# Altium project RP5-Right_Board.PrjPcb
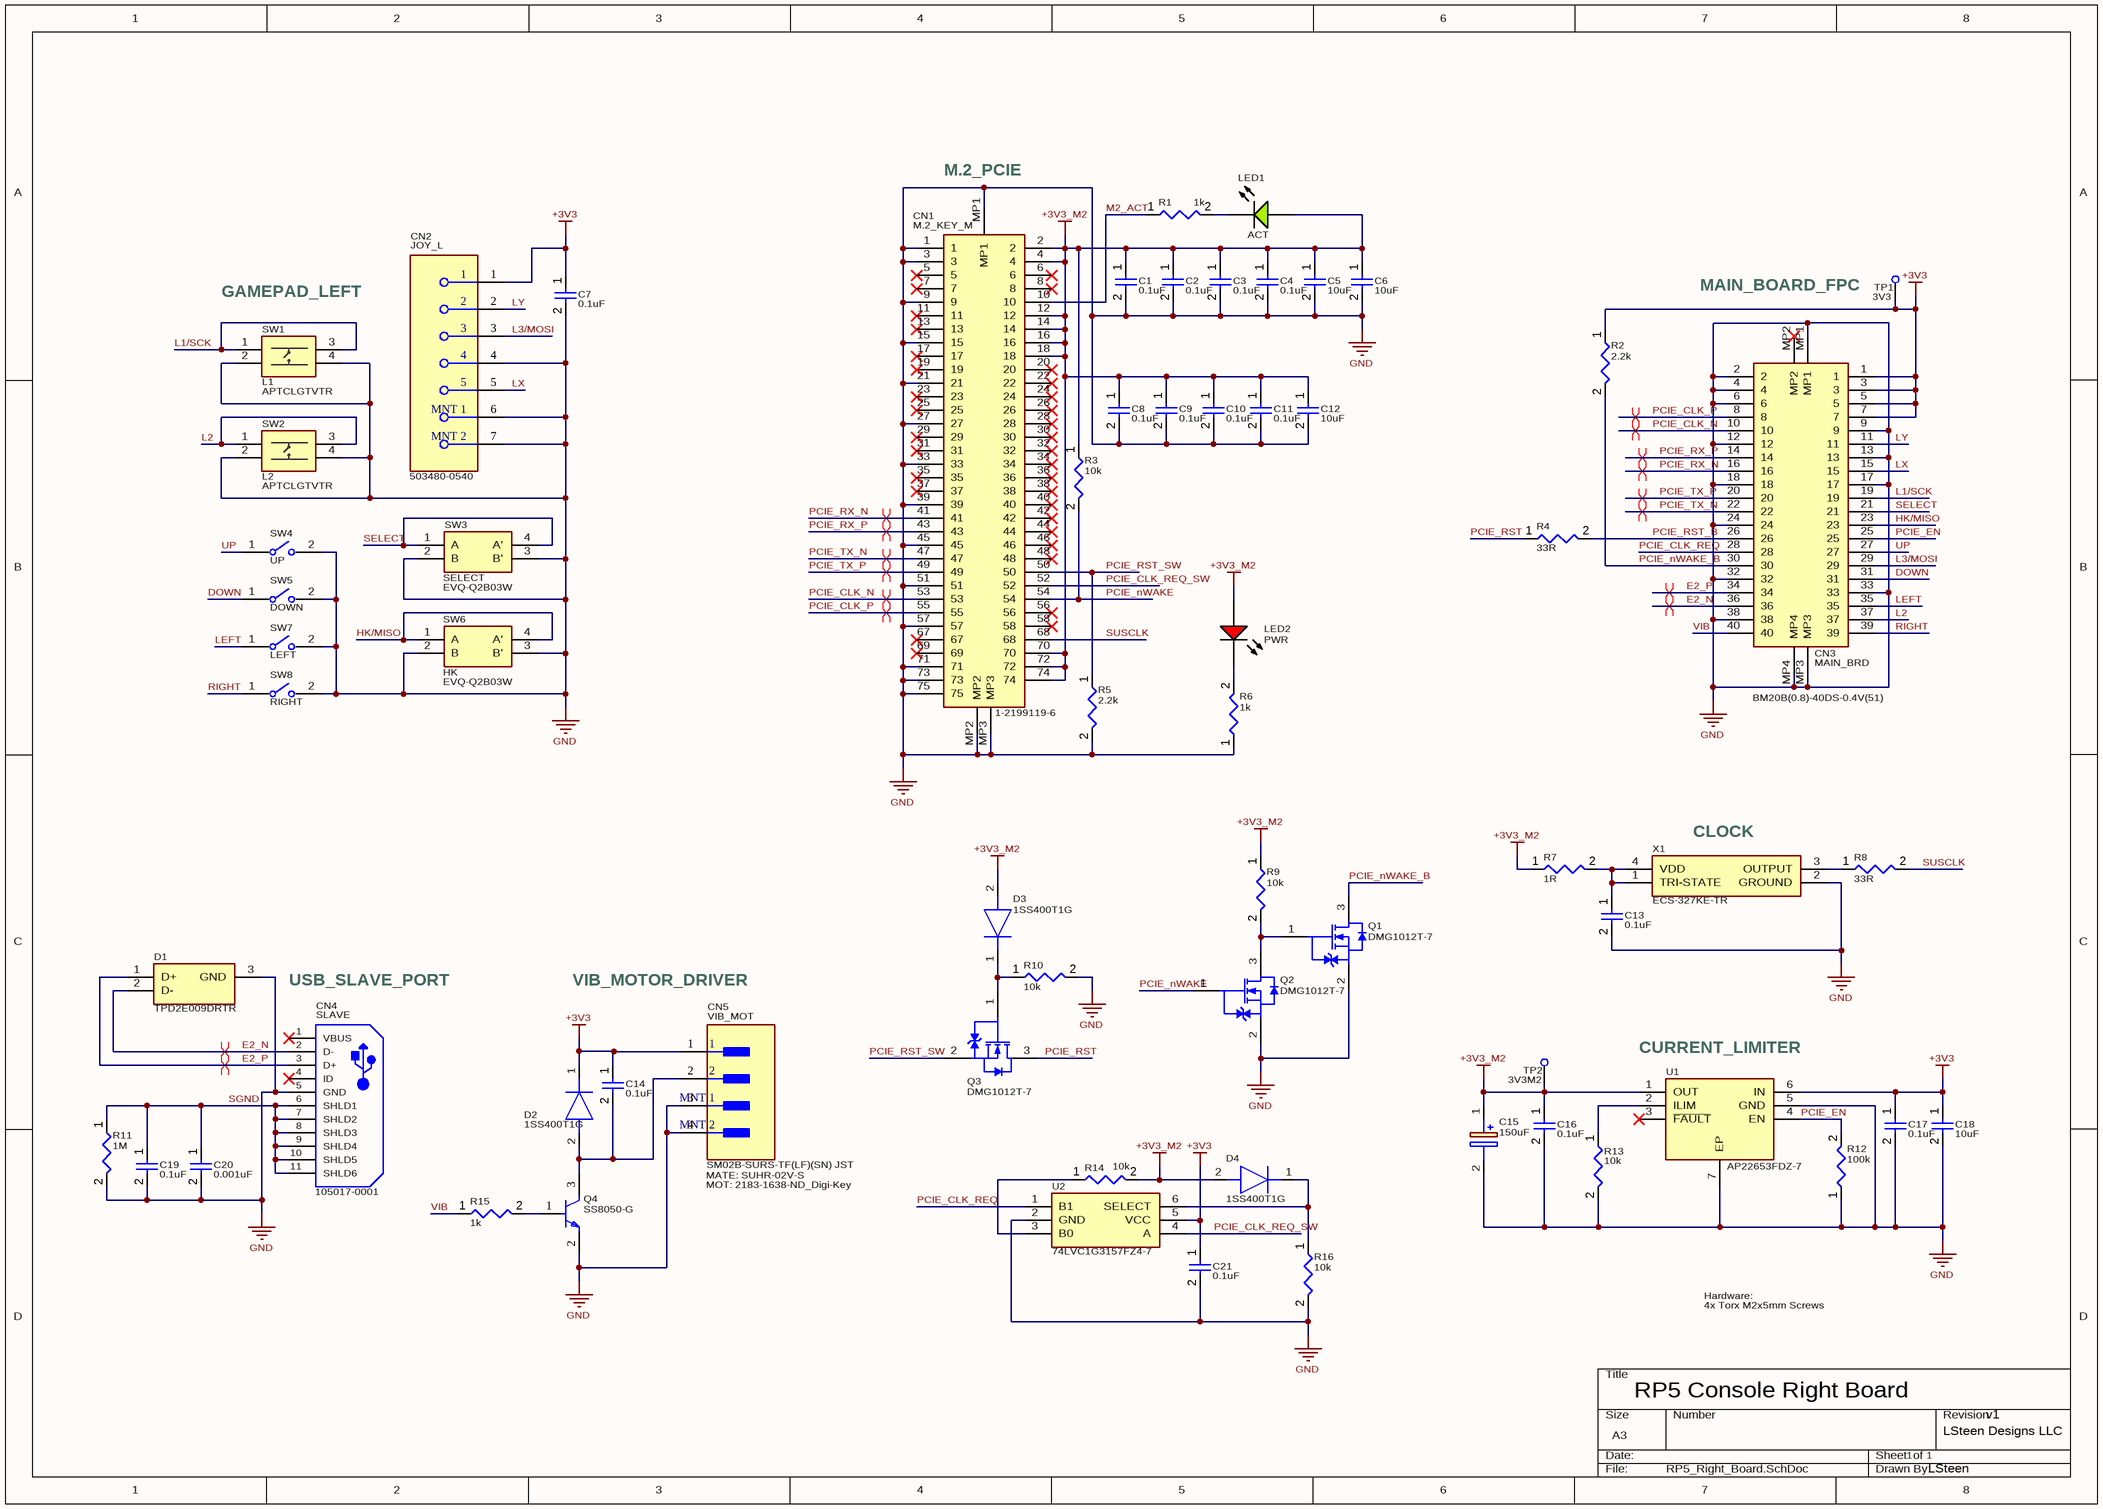
[diagram p0: RP5_Right_Board.SchDoc]
CAGE_CODE: ?????; CONTRACT_NUMBER: <CONTRACT NO>; DOC_NO_ASSY_DWG: <ASSY DWG NO>; DOC_NO_BOM: <BOM DOC NO>; DOC_NO_FAB_DWG: <FAB DWG NO>; DOC_NO_SCH_DWG: <SCH DWG NO>; PCB_2_DEC_TOL: +/-.01; PCB_3_DEC_TOL: +/-.010; PCB_ANG_TOL: +/-1/2; PCB_ASSEMBLY_NO: <PCB ASSY NO>; PCB_CHECKER: - -----; PCB_CHECKER_APP_DATE: --/--/----; PCB_DESIGNER: - -----; PCB_DESIGNER_APP_DATE: --/--/----; PCB_DWG_NO: <PCB DWG NO>; PCB_ENGINEER: - -----; PCB_ENGINEER_APP_DATE: --/--/----; PCB_PART_NUMBER: <PCB PN>; PCB_REV: A; SCH_REV: A
1 sheet, 65 parts. Net scope: global (net labels, ports and power ports of the same name join across sheets).
Board file: Right_Board.PcbDoc

## Sheet RP5_Right_Board.SchDoc
size A3; SheetNumber: 1; SheetTotal: 1; ENG_APP_DATE: --/--/--; DSN_APP_DATE: --/--/--; CHK_APP_DATE: --/--/--

### Parts
C1  0.1uF  [CAPC1005X56X25LL10T15]
C2  0.1uF  [CAPC1005X56X25LL10T15]
C3  0.1uF  [CAPC1005X56X25LL10T15]
C4  0.1uF  [CAPC1005X56X25LL10T15]
C5  10uF  [CAPC0805(2012)145_L]
C6  10uF  [CAPC0805(2012)145_L]
C7  0.1uF  [CAPC1005X56X25LL10T15]
C8  0.1uF  [CAPC1005X56X25LL10T15]
C9  0.1uF  [CAPC1005X56X25LL10T15]
C10  0.1uF  [CAPC1005X56X25LL10T15]
C11  0.1uF  [CAPC1005X56X25LL10T15]
C12  10uF  [CAPC0805(2012)145_L]
C13  0.1uF  [CAPC1005X56X25LL10T15]
C14  0.1uF  [CAPC1005X56X25LL10T15]
C15  150uF  [CAPPM7344X310N]
C16  0.1uF  [CAPC1005X56X25LL10T15]
C17  0.1uF  [CAPC1005X56X25LL10T15]
C18  10uF  [CAPC0805(2012)145_L]
C19  0.1uF  [CAPC1005X56X25LL10T15]
C20  0.001uF  [CAPC1005X56X25LL10T15]
C21  0.1uF  [CAPC1005X56X25LL10T15]
CN1  M.2_KEY_M  [121991196]
CN2  JOY_L  [FP-503480-0540-MFG]
CN3  MAIN_BRD  [BM20B0840DS04V51]
CN4  SLAVE  [105017-0001]
CN5  VIB_MOT  [FP-SM02B-SURS-TF_LF_SN-MFG]
D1  TPD2E009DRTR  [SOTFL35P100X50-3N]
D2  1SS400T1G  [SODFL1608X70N]
D3  1SS400T1G  [SODFL1608X70N]
D4  1SS400T1G  [SODFL1608X70N]
LED1  ACT  [LED_0603]
LED2  PWR  [EVRL-0603-2_V]
Q1  DMG1012T-7  [DIOD-SOT523-3_V]
Q2  DMG1012T-7  [DIOD-SOT523-3_V]
Q3  DMG1012T-7  [DIOD-SOT523-3_V]
Q4  SS8050-G  [FP-SS8050-G-MFG]
R1  1k  [RESC0402(1005)_L]
R2  2.2k  [RESC0402(1005)_L]
R3  10k  [RESC0402(1005)_L]
R4  33R  [RESC0402(1005)_L]
R5  2.2k  [RESC0402(1005)_L]
R6  1k  [RESC0402(1005)_L]
R7  1R  [RESC0402(1005)_L]
R8  33R  [RESC0402(1005)_L]
R9  10k  [RESC0402(1005)_L]
R10  10k  [RESC0402(1005)_L]
R11  1M  [RESC0402(1005)_L]
R12  100k  [RESC0402(1005)_L]
R13  10k  [RESC0402(1005)_L]
R14  10k  [RESC0402(1005)_L]
R15  1k  [RESC0402(1005)_L]
R16  10k  [RESC0402(1005)_L]
SW1  L1  [APTCLGTVTR]
SW2  L2  [APTCLGTVTR_No_Holes]
SW3  SELECT  [EVQQ2]
SW4  UP  [L4.0-W4.0-CNDV-PAD]
SW5  DOWN  [L4.0-W4.0-CNDV-PAD]
SW6  HK  [EVQQ2]
SW7  LEFT  [L4.0-W4.0-CNDV-PAD]
SW8  RIGHT  [L4.0-W4.0-CNDV-PAD]
TP1  3V3  [TP]  (no BOM)
TP2  3V3M2  [TP]  (no BOM)
U1  AP22653FDZ-7  [SON65P200X200X80-7N-D]
U2  74LVC1G3157FZ4-7  [74LVC1G3157FZ47]
X1  ECS-327KE-TR  [ECS327KETR]

### Nets
+3V3: C7.1 C14.1 C17.1 C18.1 C21.1 CN2.1 CN3.1 CN3.3 CN3.5 CN3.7 CN5.1 D2.1(K) R2.1 TP1.1 U1.6(IN) U2.5(VCC)
+3V3_M2: C1.1 C2.1 C3.1 C4.1 C5.1 C6.1 C8.1 C9.1 C10.1 C11.1 C12.1 C15.1(+) C16.1 CN1.2 CN1.4 CN1.12 CN1.14 CN1.16 CN1.18 CN1.70 CN1.72 CN1.74 D3.2(A) D4.2(A) LED1.1(A) LED2.1(A) R3.1 R7.1 R9.1 R14.2 TP2.1 U1.1(OUT)
GND: C1.2 C2.2 C3.2 C4.2 C5.2 C6.2 C7.2 C8.2 C9.2 C10.2 C11.2 C12.2 C13.2 C15.2(-) C16.2 C17.2 C18.2 C19.2 C20.2 C21.2 CN1.1 CN1.3 CN1.9 CN1.15 CN1.21 CN1.27 CN1.33 CN1.39 CN1.45 CN1.51 CN1.57 CN1.71 CN1.73 CN1.75 CN1.MP1 CN1.MP2 CN1.MP3 CN2.4 CN2.6(MNT_1) CN2.7(MNT_2) CN3.2 CN3.4 CN3.6 CN3.9 CN3.12 CN3.13 CN3.17 CN3.18 CN3.24 CN3.32 CN3.33 CN3.38 CN3.MP1 CN3.MP3 CN3.MP4 CN4.5(GND) CN5.3(MNT_1) CN5.4(MNT_2) D1.3(GND) Q1.2(S) Q2.2(S) Q4.2(E) R5.2 R6.1 R10.2 R11.2 R12.1 R13.2 R16.2 SW1.2 SW1.4 SW2.2 SW2.4 SW3.2(B) SW3.3(B') SW4.2 SW5.2 SW6.2(B) SW6.3(B') SW7.2 SW8.2 U1.5(GND) U1.7(EP) U2.2(GND) X1.2(GROUND)
DOWN: CN3.31 SW5.1
E2_N: CN3.36 CN4.2(D-) D1.2(D-)
E2_P: CN3.34 CN4.3(D+) D1.1(D+)
HK/MISO: CN3.23 SW6.1(A) SW6.4(A')
L1/SCK: CN3.19 SW1.1 SW1.3
L2: CN3.37 SW2.1 SW2.3
L3/MOSI: CN2.3 CN3.29
LEFT: CN3.35 SW7.1
LX: CN2.5 CN3.15
LY: CN2.2 CN3.11
M2_ACT: CN1.10 R1.1
PCIE_CLK_N: CN1.53 CN3.10
PCIE_CLK_P: CN1.55 CN3.8
PCIE_CLK_REQ: CN3.28 U2.1(B1)
PCIE_CLK_REQ_SW: CN1.52 U2.4(A)
PCIE_EN: CN3.25 R12.2 U1.4(EN)
PCIE_nWAKE: CN1.54 Q2.1(G) R3.2
PCIE_nWAKE_B: CN3.30 Q1.3(D) R2.2
PCIE_RST: Q3.3(D) R4.1
PCIE_RST_B: CN3.26 R4.2
PCIE_RST_SW: CN1.50 Q3.2(S) R5.1
PCIE_RX_N: CN1.41 CN3.16
PCIE_RX_P: CN1.43 CN3.14
PCIE_TX_N: CN1.47 CN3.22
PCIE_TX_P: CN1.49 CN3.20
RIGHT: CN3.39 SW8.1
SELECT: CN3.21 SW3.1(A) SW3.4(A')
SGND: C19.1 C20.1 CN4.6(SHLD1) CN4.7(SHLD2) CN4.8(SHLD3) CN4.9(SHLD4) CN4.10(SHLD5) CN4.11(SHLD6) R11.1
SUSCLK: CN1.68 R8.2
UP: CN3.27 SW4.1
VIB: CN3.40 R15.1
NetC13_1: C13.1 R7.2 X1.1(TRI-STATE) X1.4(VDD)
NetC14_2: C14.2 CN5.2 D2.2(A) Q4.3(C)
NetD3_1: D3.1(K) Q3.1(G) R10.1
NetD4_1: D4.1(K) R16.1 U2.6(SELECT)
NetLED1_2: LED1.2(K) R1.2
NetLED2_2: LED2.2(K) R6.2
NetQ1_1: Q1.1(G) Q2.3(D) R9.2
NetQ4_1: Q4.1(B) R15.2
NetR8_1: R8.1 X1.3(OUTPUT)
NetR13_1: R13.1 U1.2(ILIM)
NetR14_1: R14.1 U2.3(B0)

Not connected (* = marked no-connect by the designer): CN1 5* 6* 7* 8* 11* 13* 17* 19* 20* 22* 23* 24* 25* 26* 28* 29* 30* 31* 32* 34* 35* 36* 37* 38* 40* 42* 44* 46* 48* 56* 58* 67* 69*; CN3 MP2*; CN4 1(VBUS)* 4(ID)*; U1 3(~{FAULT})*

### Layout directives
differential pair; differential pair class USB 2.0: E2_N, E2_P
differential pair; differential pair class PCIe Gen 3x1: PCIE_CLK_N, PCIE_CLK_P, PCIE_RX_N, PCIE_RX_P, PCIE_TX_N, PCIE_TX_P

### Notes on the sheet
- M.2_PCIE
- (near SW1) GAMEPAD_LEFT
- MAIN_BOARD_FPC
- (near SW1) APTCLGTVTR
- (near SW2) APTCLGTVTR
- (near CN2) 503480-0540
- (near SW3) EVQ-Q2B03W
- (near SW6) EVQ-Q2B03W
- (near CN1) 1-2199119-6
- (near CN3) BM20B(0.8)-40DS-0.4V(51)
- (near X1) CLOCK
- USB_SLAVE_PORT
- VIB_MOTOR_DRIVER
- (near U1) CURRENT_LIMITER
- (near CN4) 105017-0001
- (near CN5) MOT: 2183-1638-ND_Digi-Key
- (near CN5) MATE: SUHR-02V-S
- (near CN5) SM02B-SURS-TF(LF)(SN) JST
- Hardware:
- 4x Torx M2x5mm Screws
- RP5 Console Right Board
- 1
- LSteen Designs LLC
- v1
- LSteen
- DWG. NO.
- REV.
- SHT.
- THIS DOCUMENT AND THE DATA DISCLOSED HEREIN OR HEREWITH IS THE PROPERTY OF ALTIUM LIMITED AND MAY BE FREELY DISTRIBUTED IN WHOLE. NO RIGHTS ARE RESERVED OR EXPRESS OR IMPLIED WARANTEE GIVEN.
- REVISION
- DESCRIPTION
- DATE
- APPROVED
- ENG:
- APPROVALS
- PROJECT
- DSN:
- CHK:
- REFERENCE DOCUMENTS
- PROJECT REVISION:
- TITLE
- DOCUMENT REVISION:
- DESIGN ITEM:
- BOM:
- FAB DWG:
- PCB DWG:
- ASSY DWG:
- SCALE:
- SIZE
- B
- CAGE CODE
- FILE NAME
- DWG NO.
- SHEET
- OF
- REV

### Library data of the parts
C1-C4 C7-C11 C13 C14 C16 C17 C19 C21 = CMP-001-00001-6: Chip Capacitor, 0.1 uF, +/- 5%, 16 V, 0402 (1005 Metric); Capacitor Type: Ceramic; Voltage Rating: 16V; Max Operating Temperature: 125°C; Min Operating Temperature: -55°C; Case/Package: 0402; Value: 0.1uF; Mounting Technology: SM; Pins: 2; Tolerance: 5%; RoHS Compliant: True
C5 C6 C12 C18 = CMP-001-00079-4: Chip Capacitor, 10µF +/-20%, 25V, 0805, Thickness 1.45 mm; Tolerance: 10%; Max Operating Temperature: 85°C; Value: 10µF; Case/Package: 0805; Voltage Rating: 25V; Min Operating Temperature: -55°C; Mounting Technology: SMT; Pins: 2
C15 = TPSD157K016S0125: Capacitor Polarised; Manufacturer_Name: AVX; Datasheet Link: http://datasheets.avx.com/TAJ.pdf; Height: 3.1mm; Manufacturer_Part_Number: TPSD157K016S0125; Mouser Part Number: 581-TPSD157K016S0125; Mouser Price/Stock: https://www.mouser.co.uk/ProductDetail/AVX/TAJD157K016RNJV?qs=%252BZP6%2F%252BtExtCxiQ2tCar1OQ%3D%3D; Arrow Part Number: TPSD157K016S0125; Arrow Price/Stock: https://www.arrow.com/en/products/tajd157k016rnjv/avx; Supplier 1: Mouser; Supplier Part Number 1: 581-TPSD157K016S0125
C20 = CMP-001-00001-6: Chip Capacitor, 0.1 uF, +/- 5%, 16 V, 0402 (1005 Metric); Capacitor Type: Ceramic; Value: 0.1uF; Voltage Rating: 16V; Max Operating Temperature: 125°C; Min Operating Temperature: -55°C; Case/Package: 0402; Mounting Technology: SM; Pins: 2; Tolerance: 5%; RoHS Compliant: True
CN1 = 1-2199119-6: M.2 PCIE KEY M Connector; Manufacturer_Name: TE Connectivity; Datasheet Link: https://www.te.com/commerce/DocumentDelivery/DDEController?Action=showdoc&DocId=Customer+Drawing%7F2199119%7FF%7Fpdf%7FEnglish%7FENG_CD_2199119_F.pdf%7F1-2199119-6; Height: 3.2mm; Manufacturer_Part_Number: 1-2199119-6; Mouser Part Number: 571-1-2199119-6; Mouser Price/Stock: https://www.mouser.co.uk/ProductDetail/TE-Connectivity/1-2199119-6?qs=I%252B29QTDM1GM6Cv1M63DAwA%3D%3D; Arrow Part Number: 1-2199119-6; Arrow Price/Stock: https://www.arrow.com/en/products/1-2199119-6/te-connectivity?region=nac; Supplier 1: Mouser; Supplier Part Number 1: 571-1-2199119-6
CN2 = CMP-00257-52963780-1: 503480-0540 Connector FFC/FPC SKT 5 Position 0.5mm Solder Right Angle Surface Mount T/R; Manufacturer Lifecycle Status: ACTIVE; Actuator Material: Glass, Nylon, Polyamide; Number of Positions: 5; Pitch: 508µm; Plating: Gold; Voltage Rating: 50V; Current Rating: 500mA; Wire/Cable Type: Straight; Contact Plating: Gold; Termination: Solder; Country of Origin: KR; Number of Rows: 1; RoHS: Compliant; NexarPartId: 52963780; Max Operating Temperature: 85°C; Lifecycle Status: Production; Mount: Surface Mount; Halogen Free: Low Halogen; Height: 2.07mm; Housing Material: Polymer; Number of Circuits: 5; Number of Contacts: 5; Min Operating Temperature: -40°C; Flammability Rating: UL94 V-0; Contact Material: Bronze, Gold, Nickel; Orientation: Right Angle
CN3 = BM20B(0.8)-40DS-0.4V(51): Connector; Manufacturer_Name: Hirose; Datasheet Link: https://datasheet.datasheetarchive.com/originals/distributors/Datasheets-DGA17/1065509.pdf; Height: 0.9mm; Manufacturer_Part_Number: BM20B(0.8)-40DS-0.4V(51); Mouser Part Number: 798-BM20B0840DS04V51; Mouser Price/Stock: https://www.mouser.co.uk/ProductDetail/Hirose-Connector/BM20B0.8-40DS-0.4V51?qs=AAveGqk956F9p8KJryTUVg%3D%3D; Supplier 1: Mouser; Supplier Part Number 1: 798-BM20B0840DS04V51; System: Connector
CN4 = 105017-0001: Micro USB Connector; Manufacturer_Name: Molex; Manufacturer_Part_Number: 105017-0001; Mouser Part Number: 538-105017-0001; Supplier 1: Mouser; Supplier 2: Digikey; Supplier Part Number 1: 538-105017-0001; Supplier Part Number 2: WM1399CT-ND
CN5 = CMP-17439-000279-1: LCSC_CONN HEADER SMD R/A 2POS 0.8MM; Number of Contacts: 2; Working Voltage: 30V; Wire/Cable Gauge: 32AWG; Gender: Male; Body Plating: Tin; Current Rating: 500mA; Lead Pitch: 0.8mm; Color: Natural; Min Operating Temperature: -25°C; Insulation Material: Nylon; Number of Rows: 1; Flammability Rating: UL94 V-0; Number of Positions: 2; Contact Shape: Rectangular; Orientation: Horizontal; Contact Material: Copper Alloy; Fastening Type: Pull; Max Operating Temperature: 85°C; Termination: Solder; Contact Type: Outer Shroud Contact; Series: SUR; Insulation Color: Natural; Packaging: Cut Tape; Contact Finish - Mating: TIN; REACH SVHC: No SVHC; Pitch: 0.8mm; Contact Plating: Tin; Lead Free: Lead Free; Voltage Rating: 30V; Mount: Surface Mount; Connector Type: Header; Number of Poles: 2; Material: Polyamide
D1 = TPD2E009DRTR: Integrated Circuit; Manufacturer_Name: Texas Instruments; Datasheet Link: https://www.ti.com/lit/ds/symlink/tpd2e009.pdf?ts=1621336941637&ref_url=https%253A%252F%252Fwww.google.com%252F; Height: 0.5mm; Manufacturer_Part_Number: TPD2E009DRTR; Mouser Part Number: 595-TPD2E009DRTR; Mouser Price/Stock: https://www.mouser.co.uk/ProductDetail/Texas-Instruments/TPD2E009DRTR?qs=XGzIaZb%2FFYLhG8oL%2FM05Rg%3D%3D; Arrow Part Number: TPD2E009DRTR; Arrow Price/Stock: https://www.arrow.com/en/products/tpd2e009drtr/texas-instruments?region=nac
D2-D4 = 1SS400T1G: Diode; Manufacturer_Name: onsemi; Datasheet Link: http://www.onsemi.com/pub/Collateral/1SS400T1-D.PDF; Height: 0.7mm; Manufacturer_Part_Number: 1SS400T1G; Mouser Part Number: 863-1SS400T1G; Mouser Price/Stock: https://www.mouser.co.uk/ProductDetail/onsemi/1SS400T1G?qs=vLkC5FC1VN8%2F6DEK%2F5shrw%3D%3D; Arrow Part Number: 1SS400T1G; Arrow Price/Stock: https://www.arrow.com/en/products/1ss400t1g/on-semiconductor?region=nac; Supplier 1: Mouser; Supplier Part Number 1: 863-1SS400T1G
LED1 = BZ-C0603-K4-E1: MPN: BZ-C0603-K4-E1
LED2 = CMP-2100-03578-1: Chip LED, Red, 5 V, 25 mA, -40 to 85 degC, 2-Pin SMD (0603), RoHS, Tape and Reel; Manufacturer: Everlight Electronics; Manufacturer Part Number: 19-217/R6C-AL1M2VY/3T; Forward Voltage: 2.2V; Lens Style: Clear; Shape: Rectangular; Forward Current: 25mA; Luminous Intensity-Nom: 20mcd; Channels: 1; Optoelectronic Device Type: SINGLE COLOR LED; Viewing Angle: 120°; Overall Height: 0.4mm; Package Reference: 0603; Case/Package: 0603; RoHSCompliant: false; Package Description: 2-Pin Surface Mount Device, Body 1.6 x 0.8 mm; Colour: Red; Lead Free: LeadFree; Datasheet URL: https://datasheet.ciiva.com/4688/el-19-217-r6c-al1m2vy-3tpdf-187026-4688713.pdf; Manufacturer URL: http://www.everlight.com/; Datasheet Version: Rev. 1, 01/2005; Supplier: Digikey; Supplier Part Number: 1080-1585-6-ND; RoHS: Yes; Category: LEDs; Mounting Technology: Surface Mount; Pins: 2; Color: Red; Min Operating Temperature: -40°C; Max Operating Temperature: 85°C; Packaging: Tape and Reel; Size: 1mm; Terminal Pitch: 1.5mm; Reach SVHC Compliant: Yes; RoHS Compliant: Yes; ComponentLink1URL: https://datasheet.ciiva.com:443/pdfs/VipMasterIC/IC/EVER/EVER-S-A0007433843/EVER-S-A0007433843-1.pdf?src-supplier=IHS+Markit; ComponentLink1Description: https://datasheet.ciiva.com:443/pdfs/VipMasterIC/IC/EVER/EVER-S-A0007433843/EVER-S-A0007433843-1.pdf?src-supplier=IHS+Markit; ComponentLink2URL: https://media.digikey.com/pdf/Data%20Sheets/Everlight%20PDFs/19-217-R6C-AL1M2VY-3T.pdf?src-supplier=Digikey; ComponentLink2Description: https://media.digikey.com/pdf/Data%20Sheets/Everlight%20PDFs/19-217-R6C-AL1M2VY-3T.pdf?src-supplier=Digikey
Q1-Q3 = CMP-2000-07450-1: N-Channel Enhancement Mode MOSFET, 20 V, 630 mA, -55 to 150 degC, 3-Pin SOT23, RoHS, Tape and Reel; Manufacturer: Diodes Inc; Continuous Drain Current (ID): 630mA; Number of Channels: 1; Drain to Source Voltage (Vdss): 20V; Gate to Source Voltage (Vgs): 6V; Turn-On Delay Time: 5.1ns; Rds On Max: 400mOhm; Power Dissipation: 280mW; Fall Time: 12.3ns; Input Capacitance: 60.67pF; Turn-Off Delay Time: 26.7ns; Rise Time: 7.4ns; Drain to Source Resistance: 300mOhm; Element Configuration: Single; Case\/Package: SOT-523; Threshold Voltage: 1V; Manufacturer URL: http://www.diodes.com/; Datasheet URL: https://www.diodes.com/assets/Datasheets/ds31783.pdf; Mount: SurfaceMount; Width: 0.85mm; REACH SVHC: NoSVHC; Datasheet Version: Rev. 3-2, 01/2012; Lead Free: LeadFree; Number of Pins: 3; Drain to Source Breakdown Voltage: 20V; Height: 0.8mm; Length: 1.7mm; Radiation Hardening: No; Packaging: TapeandReel; Contact Plating: Matte; Max Operating Temperature: 150degC; RoHSCompliant: true; Weight: 7.1E-05oz; Package Reference: SOT523-3; Package Quantity: 3000; Max Power Dissipation: 280mW; Package Description: 3-Pin Small Outline Transistor, Body 1.6 x 0.8 mm, Pitch 0.5 mm; On-State Resistance: 400MOhm; Min Operating Temperature: -55degC; Number of Elements: 1; Mounting Technology: SurfaceMount
Q4 = CMP-20235-000001-1: NPN TRANSISTOR 1.5A 40V SOT-23 R; Transition Frequency: 100MHz; Max Breakdown Voltage: 25V; Collector Emitter Voltage (VCEO): 400mV; Max Power Dissipation: 300mW; Max Collector Current: 1.5A; Case/Package: TO-236-3; Packaging: Tape and Reel; RoHS Compliant: Yes; Mount: Surface Mount; Collector Emitter Breakdown Voltage: 25V
R1 R6 R15 = CMP-009-00138-3: Chip Resistor, 1 kOhms, +/-5 %, 63 mW, -55 to 155 degC, 0402; Tolerance: 5%; Power: 63mW; Max Operating Temperature: 155°C; Pins: 2; Value: 1k; Min Operating Temperature: -55°C; Case/Package: 0402
R2 R5 = CMP-009-00138-3: Chip Resistor, 2.2 kOhms, +/-5 %, 63 mW, -55 to 155 degC, 0402; Tolerance: 5%; Power: 63mW; Max Operating Temperature: 155°C; Pins: 2; Value: 2.2k; Min Operating Temperature: -55°C; Case/Package: 0402
R3 R9 R10 R13 R14 R16 = CMP-009-00138-3: Chip Resistor, 10 kOhms, +/-5 %, 63 mW, -55 to 155 degC, 0402; Tolerance: 5%; Power: 63mW; Max Operating Temperature: 155°C; Pins: 2; Value: 10k; Min Operating Temperature: -55°C; Case/Package: 0402
R4 R8 = CMP-009-00138-3: Chip Resistor, 33 Ohms, +/-5 %, 63 mW, -55 to 155 degC, 0402; Tolerance: 5%; Power: 63mW; Max Operating Temperature: 155°C; Pins: 2; Value: 33R; Min Operating Temperature: -55°C; Case/Package: 0402
R7 = CMP-009-00138-3: Chip Resistor, 1 Ohm, +/-5 %, 63 mW, -55 to 155 degC, 0402; Tolerance: 5%; Power: 63mW; Max Operating Temperature: 155°C; Pins: 2; Value: 1R; Min Operating Temperature: -55°C; Case/Package: 0402
R11 = CMP-009-00138-3: Chip Resistor, 1 MOhms, +/-5 %, 63 mW, -55 to 155 degC, 0402; Tolerance: 5%; Power: 63mW; Max Operating Temperature: 155°C; Pins: 2; Value: 1M; Min Operating Temperature: -55°C; Case/Package: 0402
R12 = CMP-009-00138-3: Chip Resistor, 100 kOhms, +/-5 %, 63 mW, -55 to 155 degC, 0402; Tolerance: 5%; Power: 63mW; Max Operating Temperature: 155°C; Pins: 2; Value: 100k; Min Operating Temperature: -55°C; Case/Package: 0402
SW1 = APTCLGTVTR: Switch; Manufacturer_Name: Apem; Datasheet Link: https://media.digikey.com/pdf/Data%20Sheets/APEM%20Components%20PDFs/APTCLGTV.pdf; Height: 1.87mm; Manufacturer_Part_Number: APTCLGTVTR; Mouser Part Number: 642-APTCLGTVTR; Mouser Price/Stock: https://www.mouser.co.uk/ProductDetail/Apem/APTCLGTVTR?qs=ikKlZSMjbcRNf%252Bwzp31ctg%3D%3D
SW2 = APTCLGTVTR_NH: Switch; Manufacturer_Name: Apem; Datasheet Link: https://media.digikey.com/pdf/Data%20Sheets/APEM%20Components%20PDFs/APTCLGTV.pdf; Height: 1.87mm; Manufacturer_Part_Number: APTCLGTVTR; Mouser Part Number: 642-APTCLGTVTR; Mouser Price/Stock: https://www.mouser.co.uk/ProductDetail/Apem/APTCLGTVTR?qs=ikKlZSMjbcRNf%252Bwzp31ctg%3D%3D; Supplier 1: Mouser; Supplier Part Number 1: 642-APTCLGTVTR
SW3 SW6 = EVQ-Q2B03W: Switch; Manufacturer_Name: Panasonic; Datasheet Link: https://industrial.panasonic.com/cdbs/www-data/pdf/ATK0000/ATK0000C360.pdf; Manufacturer_Part_Number: EVQ-Q2B03W; Mouser Part Number: 667-EVQ-Q2B03W; Mouser Price/Stock: https://www.mouser.co.uk/ProductDetail/Panasonic/EVQ-Q2B03W?qs=WwqriLBepZtuDDVMSV2X%252BA%3D%3D; Arrow Part Number: EVQ-Q2B03W; Arrow Price/Stock: https://www.arrow.com/en/products/evq-q2b03w/panasonic; Supplier 1: Mouser; Supplier Part Number 1: 667-EVQ-Q2B03W
SW4 SW5 SW7 SW8 = CNDV_SW: Conductive Pad Switch
TP1 TP2 = TestPoint
U1 = AP22653FDZ-7: Integrated Circuit; Manufacturer_Name: Diodes Incorporated; Datasheet Link: https://www.diodes.com//assets/Datasheets/AP22652_53_52A_53A.pdf; Height: 0.8mm; Manufacturer_Part_Number: AP22653FDZ-7; Mouser Part Number: 621-AP22653FDZ-7; Mouser Price/Stock: https://www.mouser.co.uk/ProductDetail/Diodes-Incorporated/AP22653FDZ-7?qs=rkhjVJ6%2F3EKOkUb%252BFuGsGg%3D%3D; Arrow Part Number: AP22653FDZ-7; Arrow Price/Stock: https://www.arrow.com/en/products/ap22653fdz-7/diodes-incorporated?region=asia; Supplier 1: Mouser; Supplier Part Number 1: 621-AP22653FDZ-7
U2 = 74LVC1G3157FZ4-7: Integrated Circuit; Manufacturer_Name: Diodes Incorporated; Datasheet Link: https://www.diodes.com//assets/Datasheets/74LVC1G3157.pdf; Height: 0.4mm; Manufacturer_Part_Number: 74LVC1G3157FZ4-7; Mouser Part Number: 621-74LVC1G3157FZ4-7; Mouser Price/Stock: https://www.mouser.co.uk/ProductDetail/Diodes-Incorporated/74LVC1G3157FZ4-7?qs=xLhQT1EE4V8lLw6YU9%2F78g%3D%3D; Arrow Part Number: 74LVC1G3157FZ4-7; Arrow Price/Stock: https://www.arrow.com/en/products/74lvc1g3157fz4-7/diodes-incorporated?region=nac; Supplier 1: Mouser; Supplier Part Number 1: 621-74LVC1G3157FZ4-7
X1 = ECS-327KE-TR: Crystal or Oscillator; Manufacturer_Name: ECS; Datasheet Link: https://componentsearchengine.com/Datasheets/2/ECS-327KE-TR.pdf; Height: 1mm; Manufacturer_Part_Number: ECS-327KE-TR; Mouser Part Number: 520-ECS-327KE-TR; Mouser Price/Stock: https://www.mouser.co.uk/ProductDetail/ECS/ECS-327KE-TR?qs=4WriyvGnMNpSLLD8vPgMbw%3D%3D; Arrow Part Number: ECS-327KE-TR; Arrow Price/Stock: https://www.arrow.com/en/products/ecs-327ke-tr/ecs-international; Supplier 1: Mouser; Supplier Part Number 1: 520-ECS-327KE-TR